# EasyEDA Pro project ProProject_KVM-Card-Mini-HV2.6_2023-09-18.epro, schematic schematic1

## Sheets
1 VIDEO: Create Date: 2023-07-25; Page Name: VIDEO; Project Name: KVM-Card-Mini-private; Schematic Name: schematic1; Update Date: 2023-08-08; Company: 嘉立创EDA; Page Size: A3; Version: V1.0
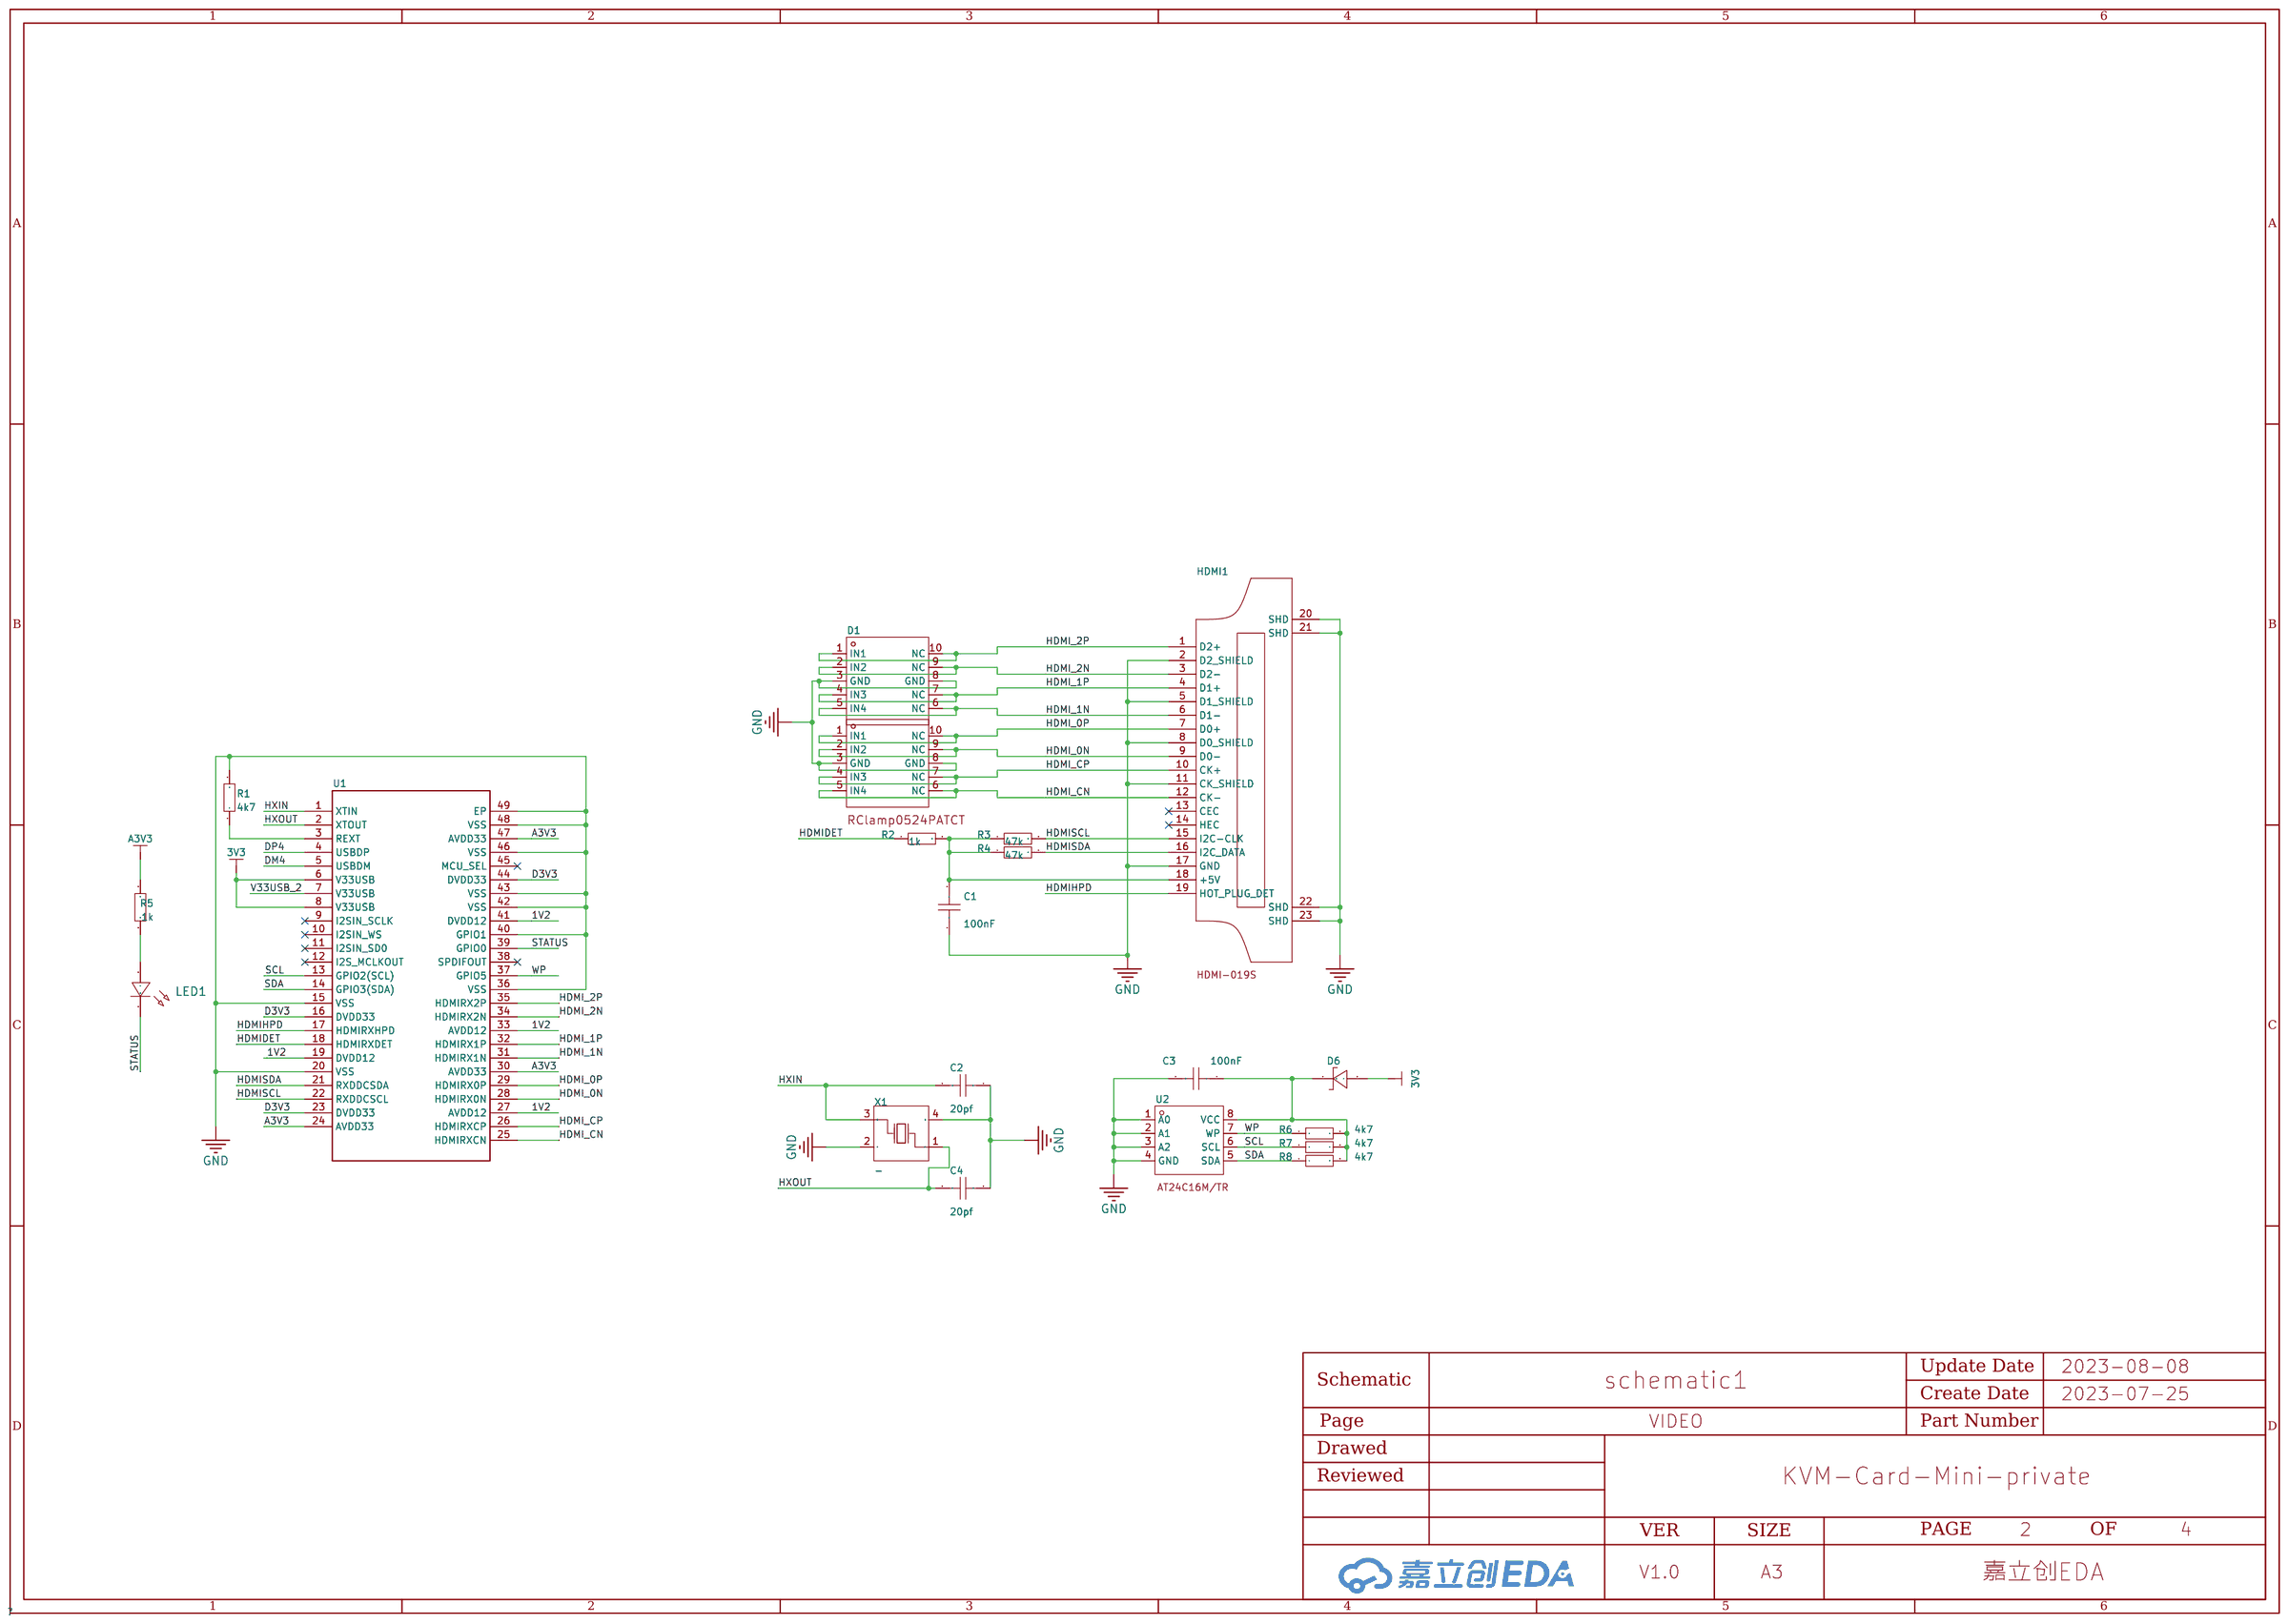
[diagram p0: VIDEO]
2 USB: Create Date: 2023-08-23; Page Name: USB; Project Name: KVM-Card-Mini-plus; Update Date: 2023-08-23
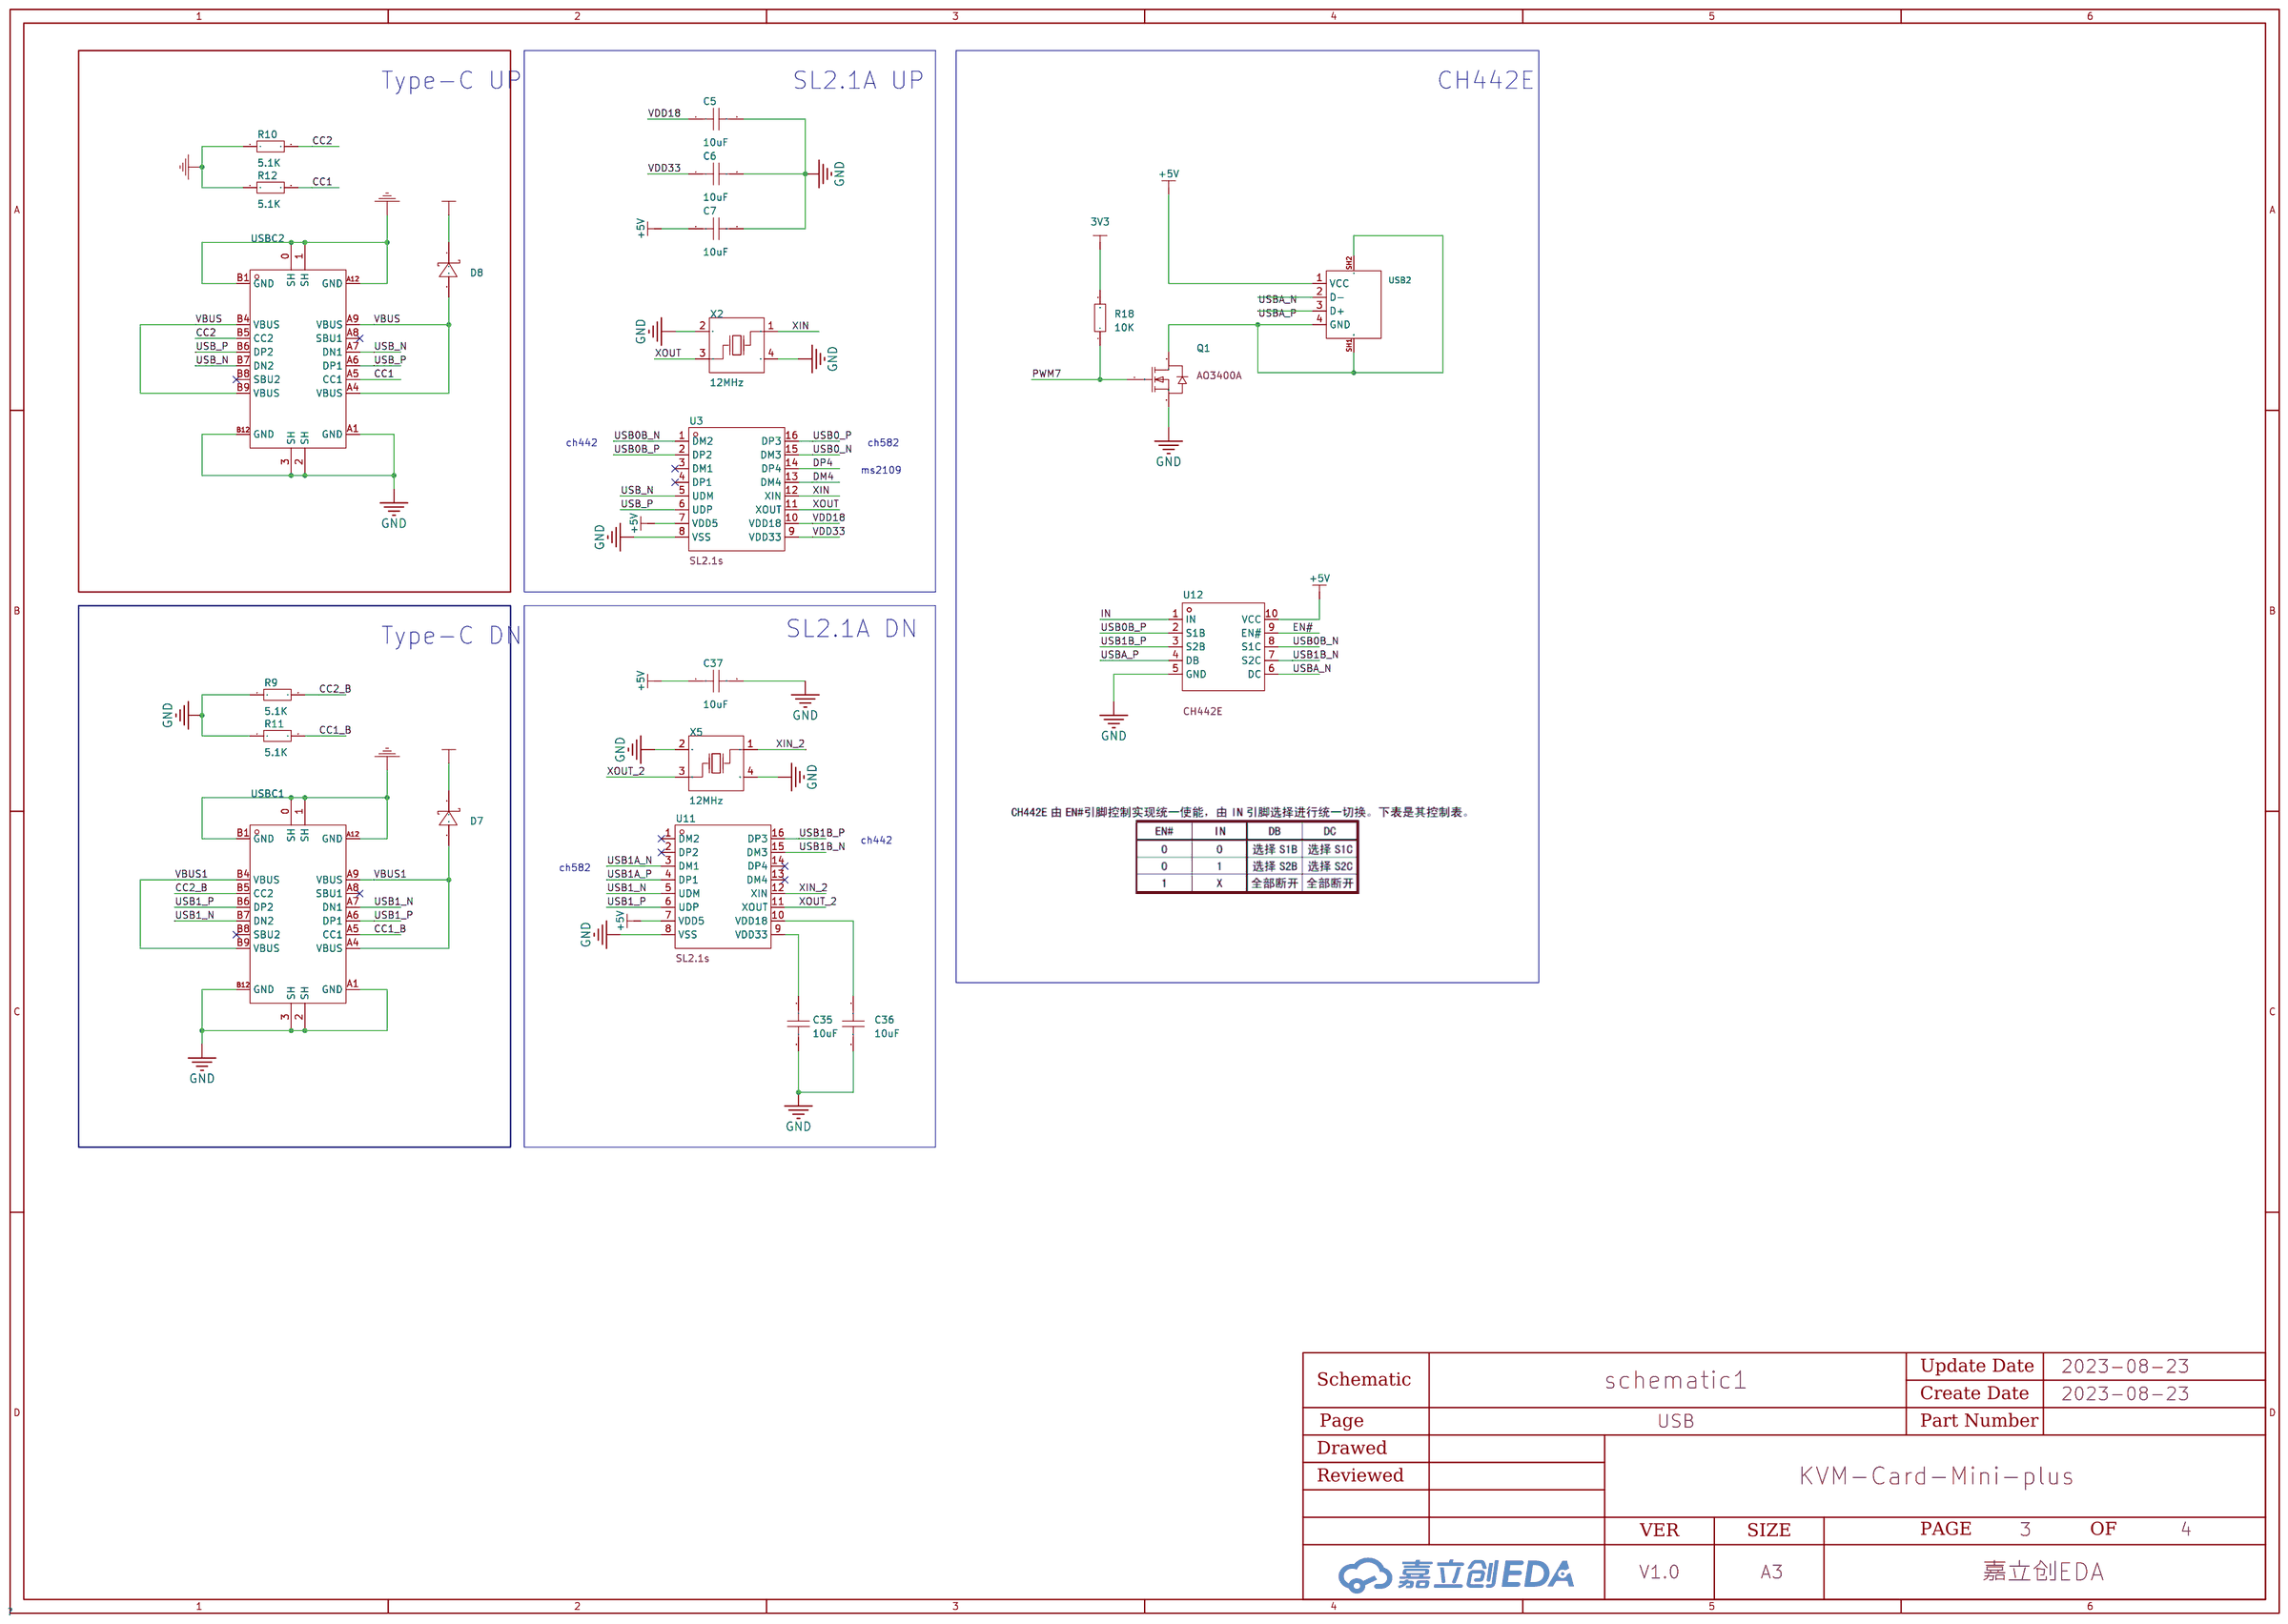
[diagram p1: USB]
3 MCU: Create Date: 2023-08-23; Page Name: MCU; Project Name: KVM-Card-Mini-plus; Update Date: 2023-08-23
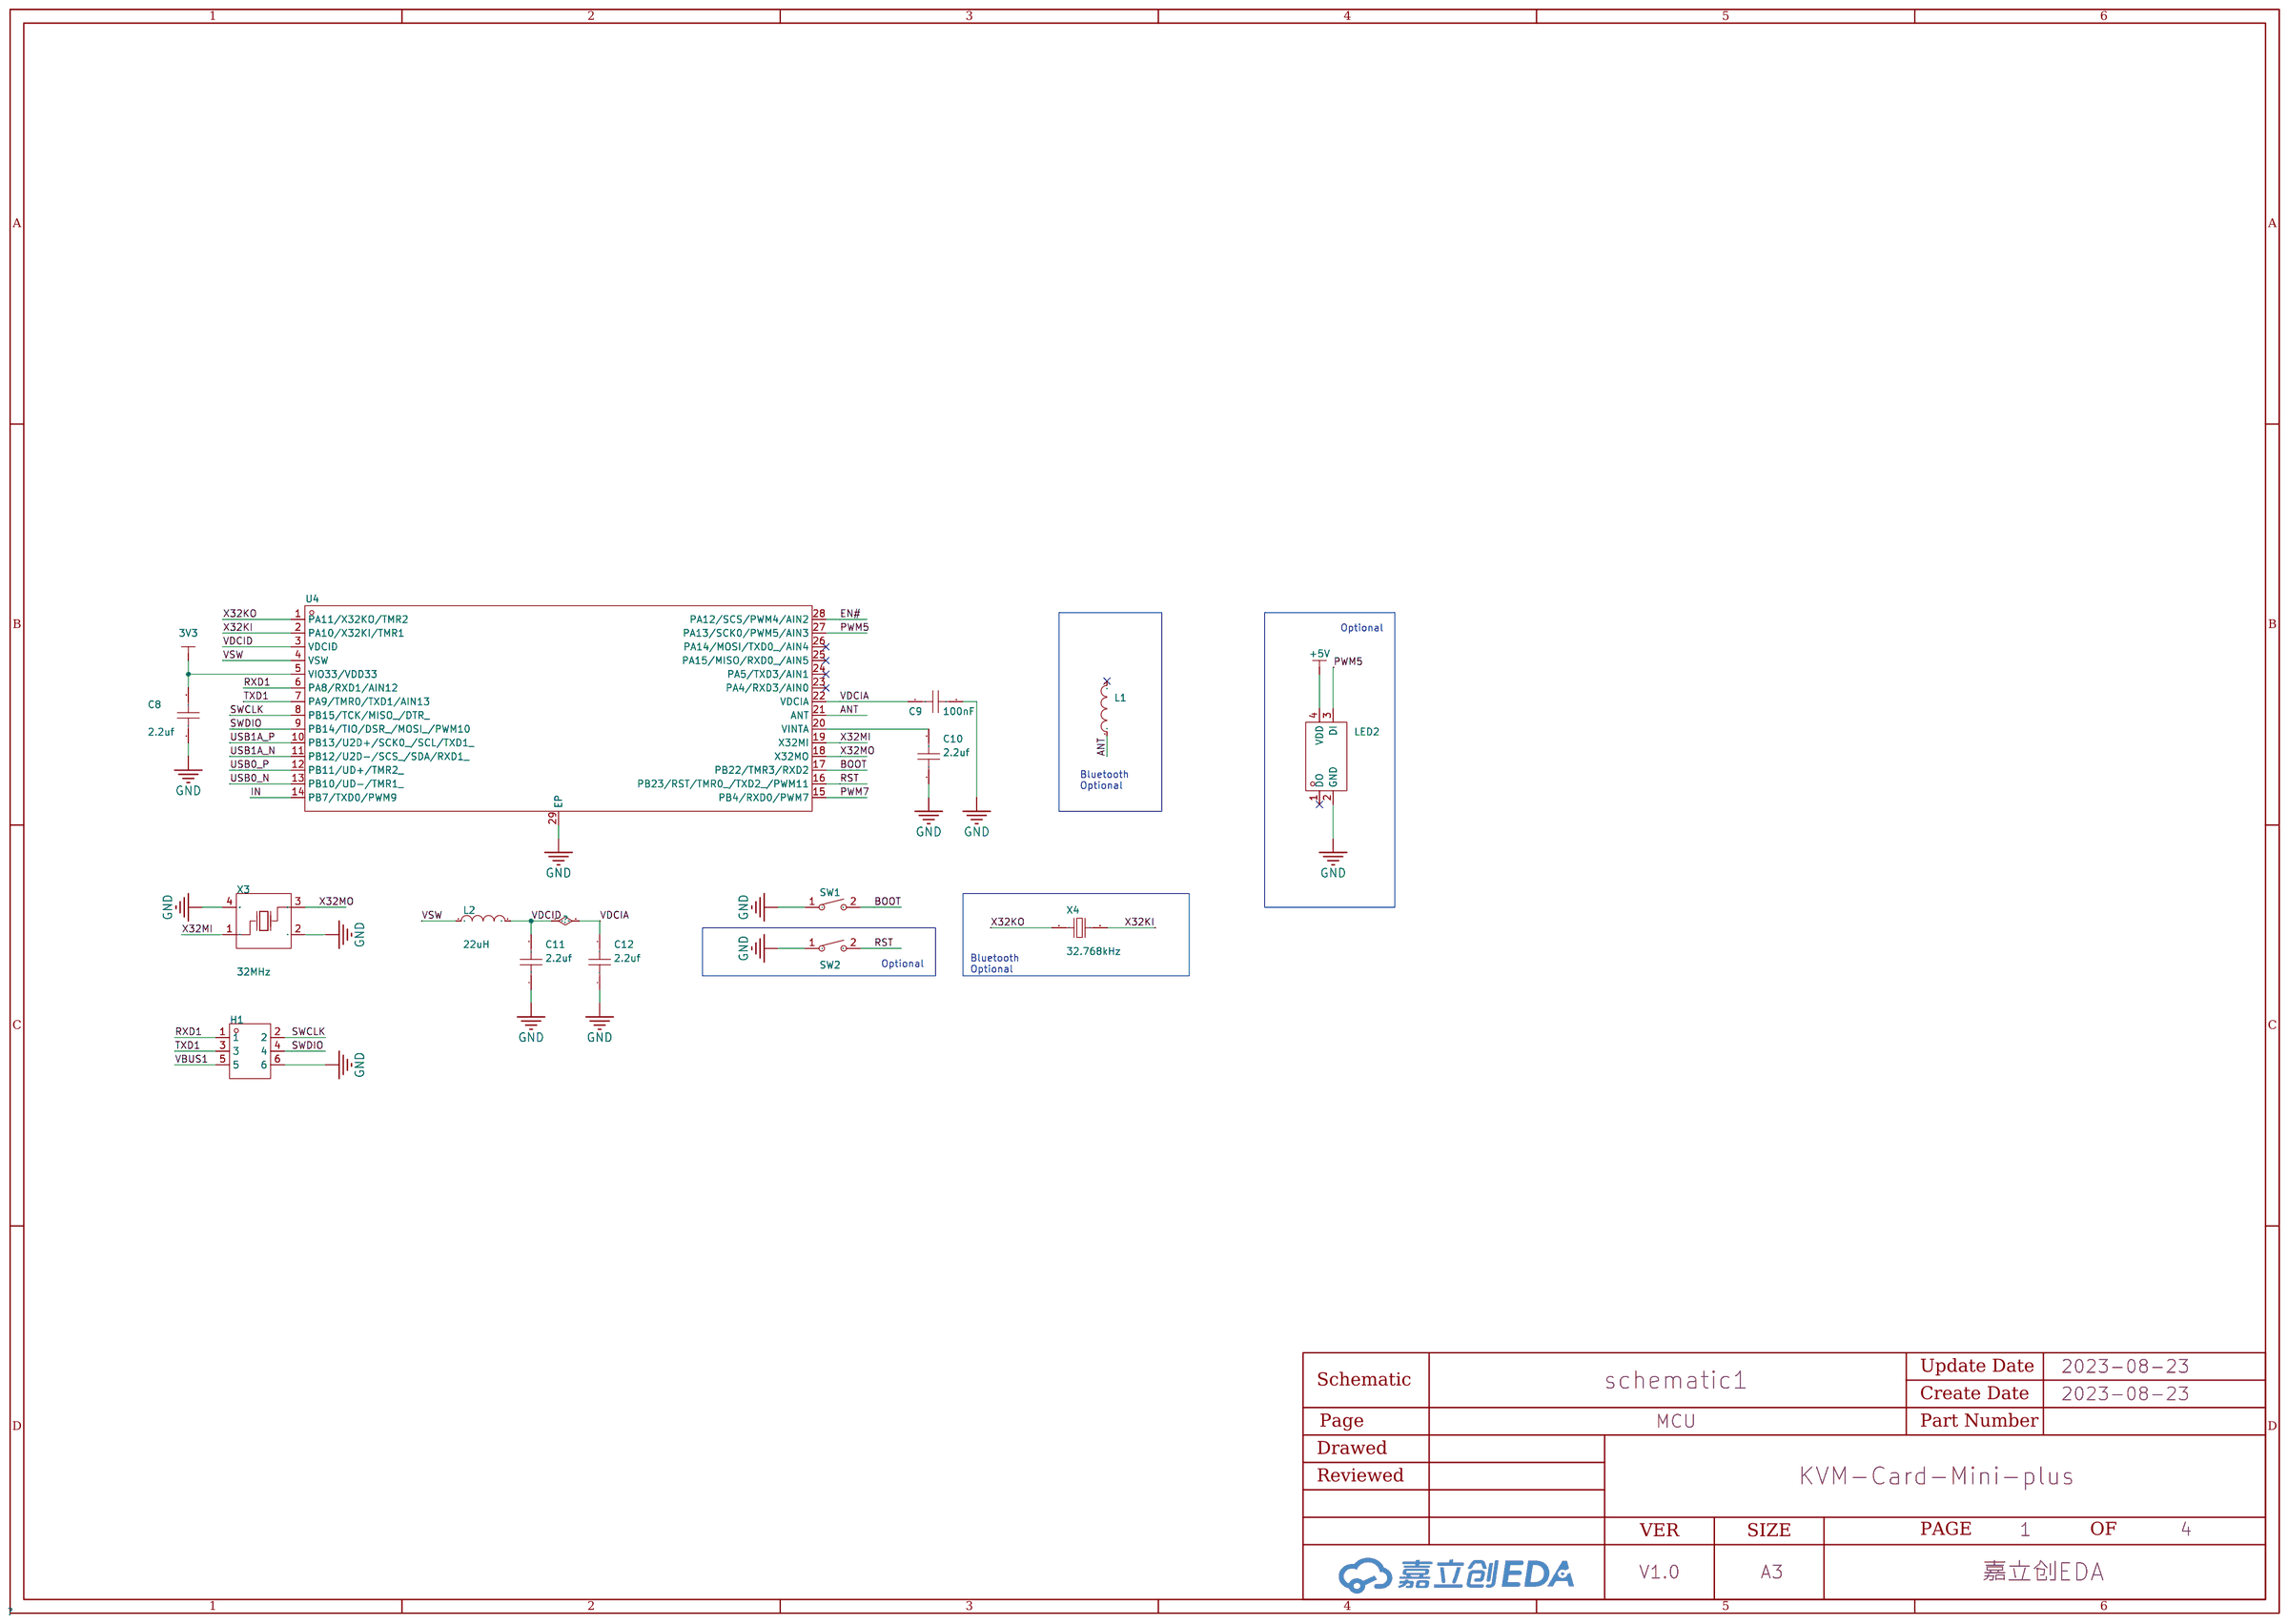
[diagram p2: MCU]
4 POWER: Page Name: POWER; Update Date: 2023-07-25
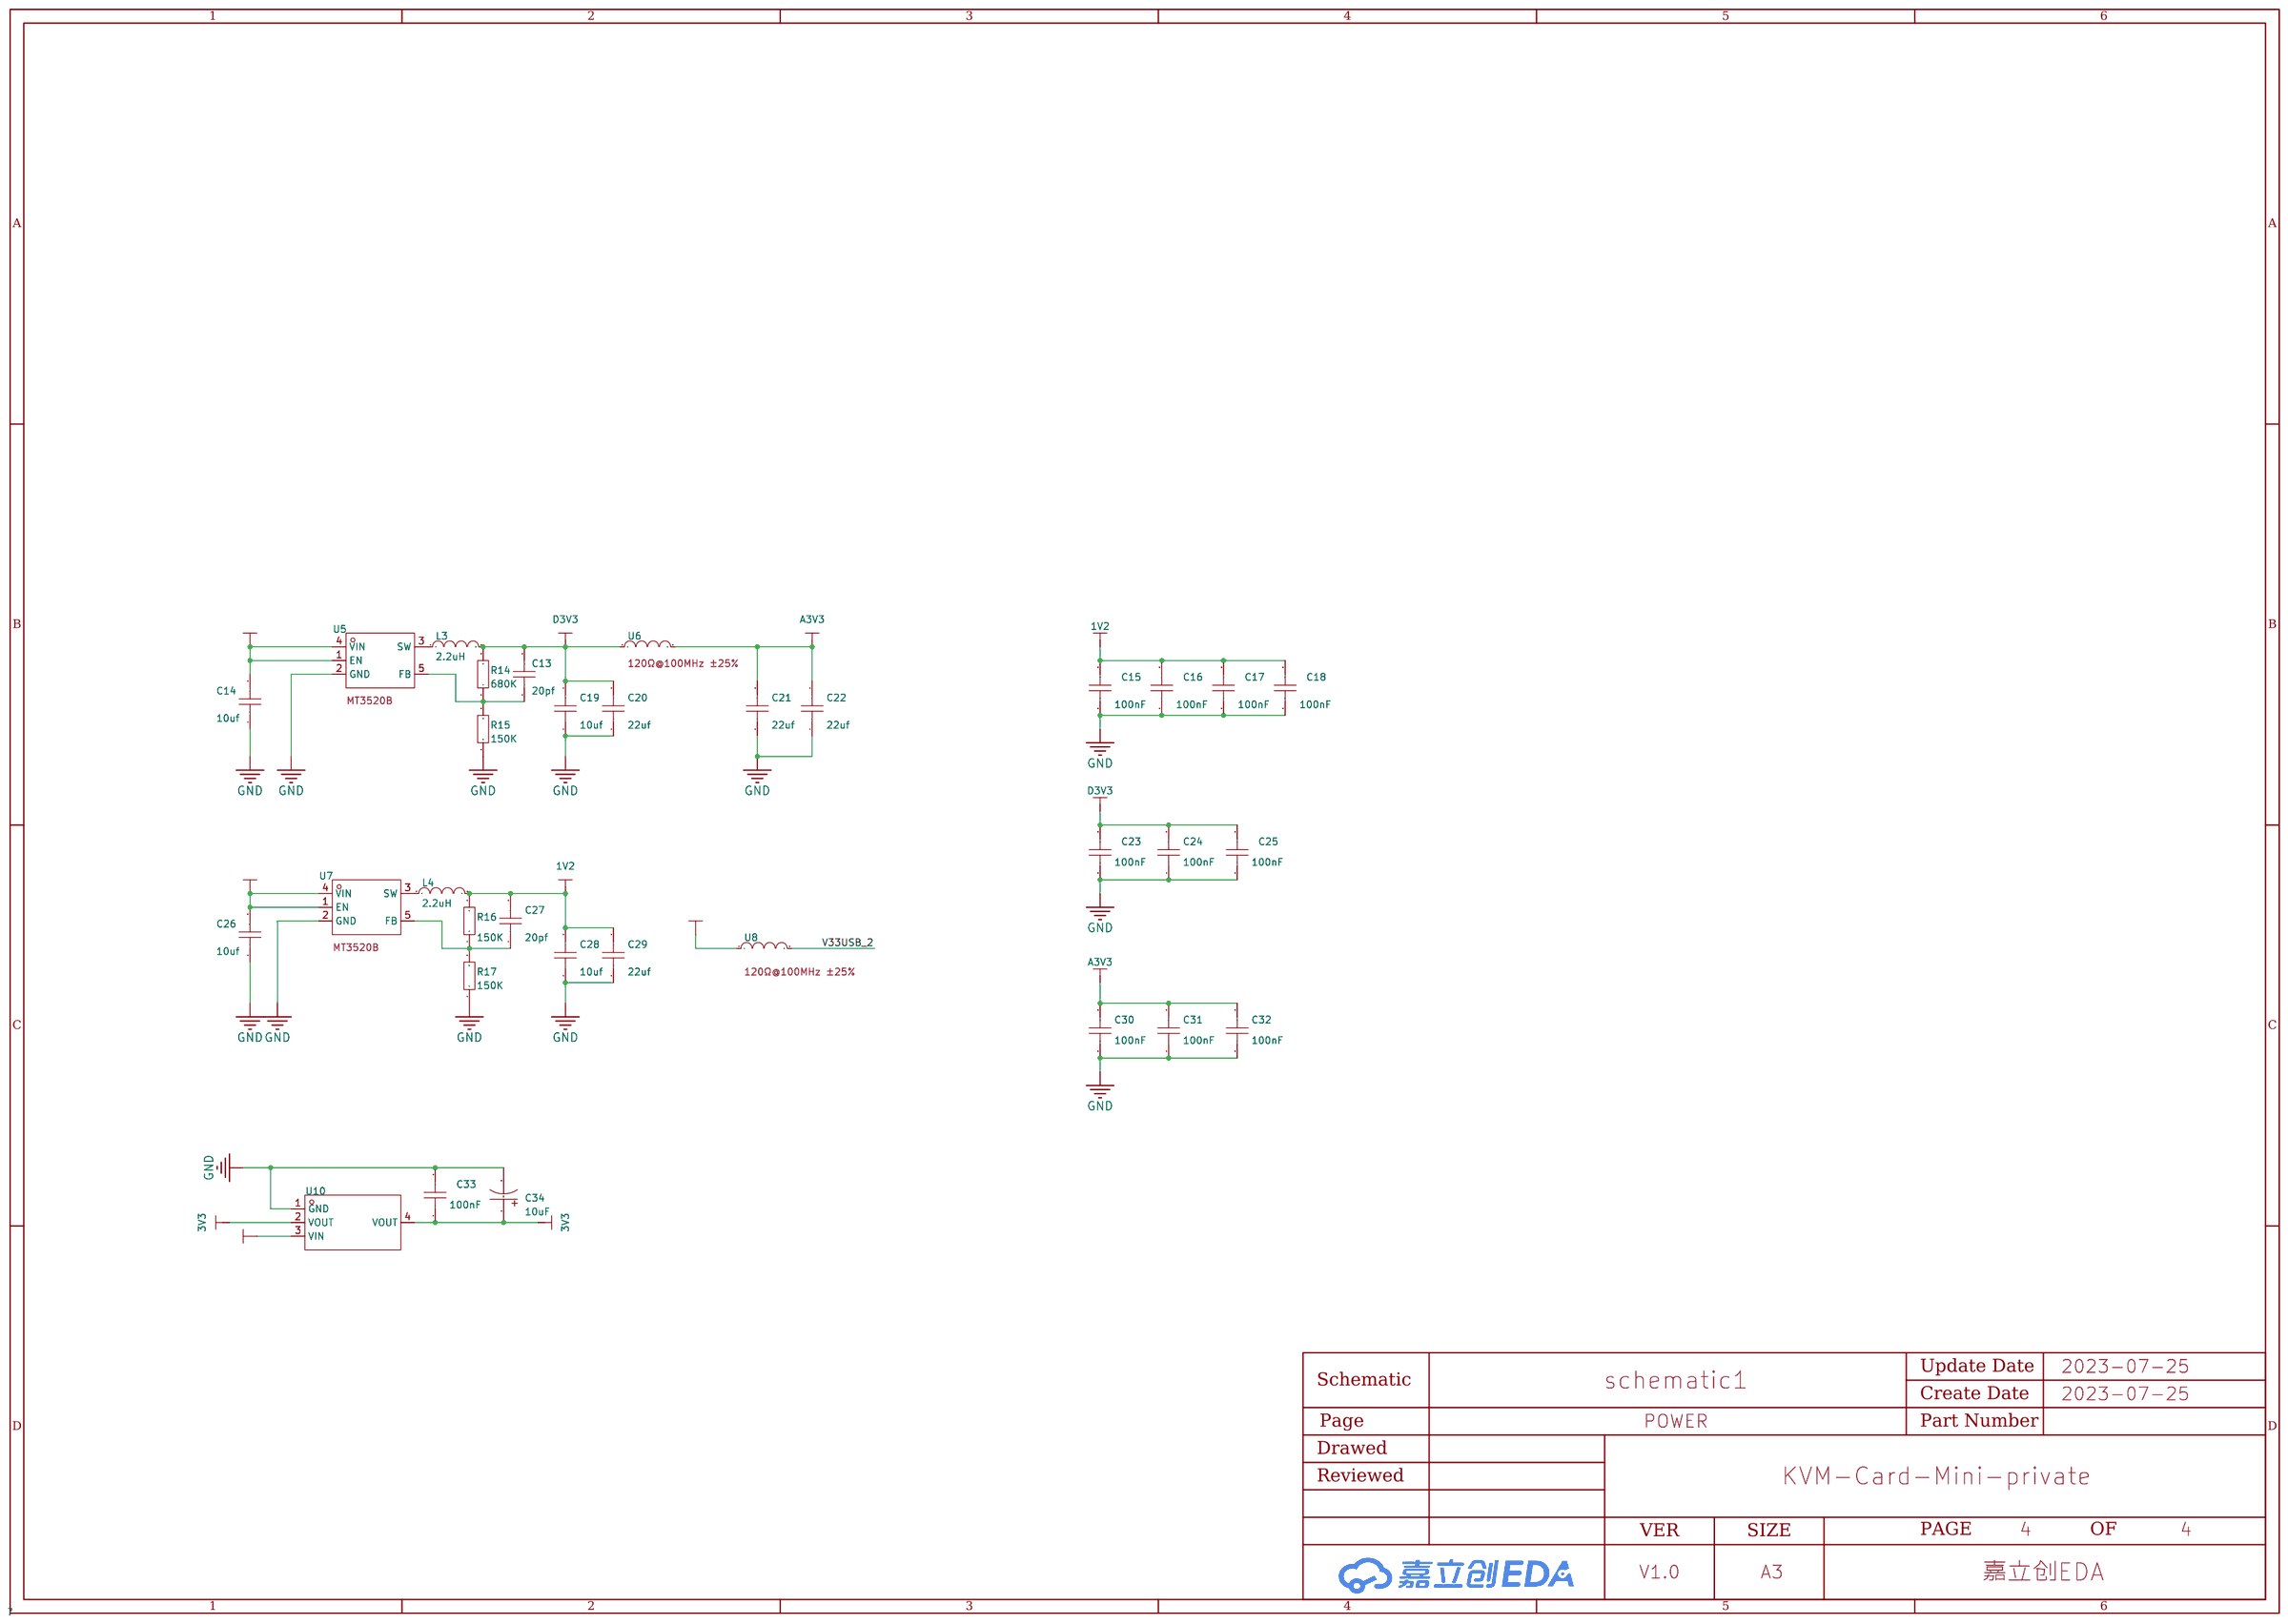
[diagram p3: POWER]

## Parts
sheet MCU
C8  2.2uf  [C0603]
C9  100nF  [C0603]
C10  2.2uf  [C0603]
C11  2.2uf  [C0603]
C12  2.2uf  [C0603]
H1  210-72-03GB01  [HDR-TH_6P-P2.54-V-R2-C3-S2.54_A2541WV-2X3P]
L1  RFECA3216060A1T  [ANT-SMD_L3.1-W1.6]
L2  22uH  [IND-SMD_L2.0-W1.6_NR201610]
LED2  WS2812B-2020  [LED-SMD_4P-L2.0-W2.0-TL_WS2812B-2020]
SW1  BOOT  [SW-SMD_L4.0-W2.9-LS5.0]
SW2  RST  [SW-SMD_L4.0-W2.9-LS5.0]
U4  CH582F  [QFN-28_L4.0-W4.0-P0.40-BL-EP2.8]
X3  32MHz  [CRYSTAL-SMD_4P-L2.0-W1.6-BL-2]
X4  32.768kHz  [FC-135R_L3.2-W1.5]
sheet POWER
C13  20pf  [C0603]
C14  10uf  [C0603]
C15  100nF  [C0603]
C16  100nF  [C0603]
C17  100nF  [C0603]
C18  100nF  [C0603]
C19  10uf  [C0603]
C20  22uf  [C0603]
C21  22uf  [C0603]
C22  22uf  [C0603]
C23  100nF  [C0603]
C24  100nF  [C0603]
C25  100nF  [C0603]
C26  10uf  [C0603]
C27  20pf  [C0603]
C28  10uf  [C0603]
C29  22uf  [C0603]
C30  100nF  [C0603]
C31  100nF  [C0603]
C32  100nF  [C0603]
C33  100nF  [C0603]
C34  10uF  [CASE-A_3216]
L3  2.2uH  [IND-SMD_L2.0-W1.6]
L4  2.2uH  [IND-SMD_L2.0-W1.6]
R14  680K  [R0603]
R15  150K  [R0603]
R16  150K  [R0603]
R17  150K  [R0603]
U5  -  [SOT-23-5_L3.0-W1.7-P0.95-LS2.8-BR]
U6  BLM18PG121SN1D  [L0603]
U7  -  [SOT-23-5_L3.0-W1.7-P0.95-LS2.8-BR]
U8  BLM18PG121SN1D  [L0603]
U10  AMS1117-3.3  [SOT-223-3_L6.5-W3.4-P2.30-LS7.0-BR]
sheet USB
C5  10uF  [C0603]
C6  10uF  [C0603]
C7  10uF  [C0603]
C35  10uF  [C0603]
C36  10uF  [C0603]
C37  10uF  [C0603]
D7  SS34  [SMA_L4.3-W2.6-LS5.2-RD]
D8  SS34  [SMA_L4.3-W2.6-LS5.2-RD]
Q1  AO3400A  [SOT-23-3_L2.9-W1.6-P1.90-LS2.8-BR]
R9  5.1K  [R0603]
R10  5.1K  [R0603]
R11  5.1K  [R0603]
R12  5.1K  [R0603]
R18  10K  [R0603]
U3  SL2.1s  [SSOP-16_L4.6-W2.6-P0.53-LS4.0-BL]
U11  SL2.1s  [SSOP-16_L4.6-W2.6-P0.53-LS4.0-BL]
U12  CH442E  [MSOP-10_L3.0-W3.0-P0.50-LS5.0-BL]
USB2  902-131A1011D10100  [USB-A-TH__USB-AF-90]
USBC1  TYPE-C-31-M-12  [USB-C_SMD-TYPE-C-31-M-12]
USBC2  TYPE-C-31-M-12  [USB-C_SMD-TYPE-C-31-M-12]
X2  12MHz  [CRYSTAL-SMD_4P-L3.2-W2.5-BL]
X5  12MHz  [CRYSTAL-SMD_4P-L3.2-W2.5-BL]
sheet VIDEO
C1  100nF  [C0603]
C2  20pf  [C0603]
C3  100nF  [C0603]
C4  20pf  [C0603]
D1  -  [SLP2510P8_L2.5-W1.0-P0.50-BL]
D2  -  [SLP2510P8_L2.5-W1.0-P0.50-BL]
D6  1N5819WS  [SOD-323_L1.8-W1.3-LS2.5-RD]
HDMI1  -  [HDMI-SMD_HDMI-019S]
LED1  -  [LED_0603]
R1  4k7  [R0603]
R2  1k  [R0603]
R3  47k  [R0603]
R4  47k  [R0603]
R5  1k  [R0603]
R6  4k7  [R0603]
R7  4k7  [R0603]
R8  4k7  [R0603]
U1  MS2109  [QFN-48_L7.0-W7.0-P0.50-TL-EP4.1]
U2  -  [SOP-8_L4.9-W3.9-P1.27-LS6.0-BL]
X1  -  [OSC-SMD_4P-L3.2-W2.5-BL]

## Library data of the parts
C1-C4 C8-C33 = CAP_0603: 容值:100nF;精度:±10%;额定电压:50V;温度系数:X7R;; Supplier Footprint: 0603
H1 = 210-72-03GB01: 排数:双排;总PIN位数:6;间距:2.54mm;插针结构:2x3P;行距:2.54mm;安装类型:直插;圆针/方针:方针;额定电流:-;额定电压:-;配合针长度:6.1mm;塑高:2.5mm;端接针长度:3mm;触头材质:黄铜;触头镀层:-;工作温度范围:-40℃~+105℃;颜色:黑色;; LCSC Part Name: 2.54mm 2x3P 直插 方针; Supplier Part: C402781; Manufacturer: PINREX(频锐科技); Supplier Footprint: 直插,P=2.54mm; JLCPCB Part Class: 扩展库; Datasheet: https://atta.szlcsc.com/upload/public/pdf/source/20190710/C402781_43A1999CD2F74066250BE88CD0917A4C.pdf; Supplier: LCSC; Number of Rows: 双排; Number of Pins: 6; Pitch: 2.54mm; Pin Structure: 2x3P; Row Spacing: 2.54mm; Mounting Type: 直插; Circluar Pins/Square Pins: 方针; Length of Mating Pin: 6.1mm; Insulation Height: 2.5mm; Length of End Connection Pin: 3mm; Contact Material: 黄铜; Operating Temperature Range: -40℃~+105℃; Color: 黑色
L1 = RFECA3216060A1T: 2.4 GHz 陶瓷天线; Supplier Part: C127620; Manufacturer: Walsin(华新科); Supplier Footprint: 贴片; JLCPCB Part Class: 扩展库; Datasheet: https://atta.szlcsc.com/upload/public/pdf/source/20180326/C127620_3C564CCA307EE04222EAFCE04B7FD99A.pdf; Supplier: LCSC
L2 = YNR2016-220M: 电感值:22uH;精度:±20%;额定电流:300mA;饱和电流(Isat):300mA;; LCSC Part Name: 22uH ±20% 300mA 1.7Ω; Supplier Part: C2858408; Manufacturer: YJYCOIN(益嘉源); Supplier Footprint: SMD,2x1.6x1.05mm; JLCPCB Part Class: 扩展库; Datasheet: https://atta.szlcsc.com/upload/public/pdf/source/20220803/D55B945E8F3B883D081ACE749E0E15DB.pdf; Supplier: LCSC; Tolerance: ±20%; Rated Current: 300mA; Saturation Current (Isat): 300mA; DC Resistance (DCR): 1.7Ω
LED2 = WS2812B-2020: 发光颜色:RGB三色;二极管配置:-;透镜颜色:-;主波长:470.4nm；622.5nm；515.6nm;峰值波长:-;色温:-;测试电流:12mA;功率:-;发光角度:-;安装方式:-;工作温度:-;; LCSC Part Name: RGB三色 470.4nm 515.6nm 622.5nm （注意防潮，请查阅规格书中对应具体内容）; Supplier Part: C965555; Manufacturer: worldsemi; Supplier Footprint: SMD,2x2mm; JLCPCB Part Class: 扩展库; Datasheet: https://atta.szlcsc.com/upload/public/pdf/source/20201203/C965555_5C919C4B6231E6ADE06011FB0D94282B.pdf; Supplier: LCSC; Emitted Color: RGB三色; Dominant Wavelength: 470.4nm；622.5nm；515.6nm; Forward Current: 12mA
SW1 SW2 = TS342A2P-WZ: 触点电流:50mA;额定电压(DC):12V;绝缘电阻:100MΩ;电路结构:单刀单掷;安装方式:立贴;按钮形状:圆形按钮;按钮/盖帽颜色:黑色;机械寿命:30000;工作温度:-25℃~+70℃;引脚样式:SMD接片;开关长度:3.95mm;开关宽度:2.9mm;开关高度:2mm;带支架:否;; LCSC Part Name: 轻触开关 3*4*2 两脚小龟不带柱 250gf 黑色塑胶按钮; Supplier Part: C557591; Manufacturer: SHOU HAN(首韩); Supplier Footprint: SMD; JLCPCB Part Class: 扩展库; Datasheet: https://atta.szlcsc.com/upload/public/pdf/source/20200519/C557591_B3A5A21584733303F06306F18577DA8B.pdf; Supplier: LCSC; Contact Current: 50mA; Voltage Rating (DC): 12V; Insulation Resistance: 100MΩ; Circuit: 单刀单掷; Mounting Style: 立贴; Actuator Style: 圆形按钮; Actuator/Cap Color: 黑色; Mechanical Life: 30000; Operating Temperature: -25℃~+70℃; Pin Style: SMD接片; Switch Length: 3.95mm; Switch Width: 2.9mm; Switch Height: 2mm; Strike Gundam: 否
U4 = CH582F: Supplier Part: C3001175; Manufacturer: WCH(南京沁恒); Supplier Footprint: QFN28; JLCPCB Part Class: 扩展库; Datasheet: https://atta.szlcsc.com/upload/public/pdf/source/20220425/D81D4537E275CD6C7C3E77BC95B144F3.pdf; Supplier: LCSC
X3 = XL7EL89COI-111YLC-32M: 频率:32MHz;频率公差:±10ppm;负载电容:12pF;; LCSC Part Name: 32MHz ±10ppm 12pF YSX211SL; Supplier Part: C2965584; Manufacturer: YXC(扬兴晶振); Supplier Footprint: SMD2016-4P; Datasheet: https://atta.szlcsc.com/upload/public/pdf/source/20220121/6B4B3E7EF7974858943D806BF8CACEA3.pdf; Supplier: LCSC; Crystal Type: 贴片无源晶振; Frequency Tolerance: ±10ppm; Frequency Stability: ±20ppm; Load Capacitance: 12pF; Operating Temperature: -40℃~+85℃
X4 = Q13FC1350000400: 晶振类型:贴片无源晶振;频率:32.768kHz;频率公差:±20ppm;负载电容:12.5pF;等效串联电阻(ESR):70kΩ;工作温度:-40℃~+85℃;; LCSC Part Name: 32.768kHz ±20ppm 12.5pF; Supplier Part: C32346; Manufacturer: EPSON(爱普生); Supplier Footprint: SMD3215-2P; JLCPCB Part Class: 基础库; Datasheet: https://atta.szlcsc.com/upload/public/pdf/source/20190108/C32346_746D6B07EAF90824457A96480007685F.pdf; Supplier: LCSC; Crystal Type: 贴片无源晶振; Frequency Tolerance: ±20ppm; Load Capacitance: 12.5pF; Equivalent Series Resistance (ESR): 70kΩ; Operating Temperature: -40℃~+85℃
C34 = CA45-A-6.3V-10uF-K: 容值:10uF;精度:±10%;额定电压:6.3V;等效串联电阻:8Ω@100kHz;; LCSC Part Name: 10uF ±10% 6.3V; Supplier Part: C128255; Manufacturer: CEC(振华新云); Supplier Footprint: CASE-A-3216; JLCPCB Part Class: 扩展库; Datasheet: https://atta.szlcsc.com/upload/public/pdf/source/20180125/C128255_15168614678451301481.pdf; Supplier: LCSC; Tolerance: ±10%; Rated Voltage: 6.3V; Equivalent Series Resistance(ESR): 8Ω@100kHz; Operating Temperature: -55℃~+125℃
L3 L4 = CKCS201610-2.2uH/M: 电感值:2.2uH;精度:±20%;额定电流:1.1A;; LCSC Part Name: 2.2uH ±20% 1.1A 264mΩ; Supplier Part: C354533; Manufacturer: CENKER(岑科); Supplier Footprint: SMD; JLCPCB Part Class: 扩展库; Datasheet: https://atta.szlcsc.com/upload/public/pdf/source/20190315/C354533_59121B22FE01331804674A67C9C7C2C4.pdf; Supplier: LCSC; Tolerance: ±20%; Rated Current: 1.1A; DC Resistance (DCR): 264mΩ
R1-R12 R14-R18 = Res_0603: Supplier Footprint: 0603
U5 U7 = MT3520B_2: Pin Type: IN; Supplier: LCSC; Supplier Part: C2684933; Manufacturer: 西安航天民芯; Manufacturer Part: MT3520B; JLCPCB Part Class: Extended Part
U6 U8 = BLM18PG121SN1D: 标称阻抗@测试频率:120Ω@100MHz;误差:±25%;直流电阻(RDC):50mΩ;额定电流:2A;电路数:1;; LCSC Part Name: 120Ω@100MHz ±25%; Supplier Part: C14709; Manufacturer: muRata(村田); Supplier Footprint: SMD; JLCPCB Part Class: 扩展库; Datasheet: https://atta.szlcsc.com/upload/public/pdf/source/20130704/1457706621134.pdf; Supplier: LCSC; Impedance @ Frequency: 120Ω@100MHz; Tolerance: ±25%; DC Resistance: 50mΩ; Current Rating: 2A; Circuits: 1
U10 = AMS1117-3.3_C6186: 输出类型:固定;输出极性:正;最大输入电压:-;输出电压:3.3V;输出电流:1A;电源纹波抑制比(PSRR):72dB@(120Hz);; LCSC Part Name: 输出3.3V 1A; Supplier Part: C6186; Manufacturer: AMS; Supplier Footprint: SOT-223; JLCPCB Part Class: 基础库; Datasheet: https://atta.szlcsc.com/upload/public/pdf/source/20180727/C6186_7A095716F0823C02F1997A905E26C086.pdf; Supplier: LCSC; Output Type: 固定; Output Polarity: 正; Number of Outputs: 1; Output Voltage: 3.3V; Dropout Voltage: 1.3V@(800mA); Output Current: 1A; Power Supply Rejection Ratio (PSRR): 72dB@(120Hz)
C5-C7 C35-C37 = CL10A106MA8NRNC: 容值:10uF;精度:±20%;额定电压:25V;温度系数:X5R;; LCSC Part Name: 10uF ±20% 25V; Supplier Part: C96446; Manufacturer: SAMSUNG(三星); Supplier Footprint: 0603; JLCPCB Part Class: Basic Part; Datasheet: https://atta.szlcsc.com/upload/public/pdf/source/20170325/1490427913016.pdf; Supplier: LCSC; Tolerance: ±20%; Voltage Rated: 25V; Temperature Coefficient: X5R
D7 D8 = SS34_C8678: 二极管配置:独立式;直流反向耐压(Vr):40V;平均整流电流(Io):3A;正向压降(Vf):550mV@3A;; LCSC Part Name: 40V 3A 550mV@3A; Supplier Part: C8678; Manufacturer: MDD; Supplier Footprint: SMA(DO-214AC); JLCPCB Part Class: 基础库; Datasheet: https://atta.szlcsc.com/upload/public/pdf/source/20230314/A80AE34493C69B89E2F4B1712F433538.pdf; Supplier: LCSC; Diode Configuration: 独立式; Reverse Voltage (Vr): 40V; Average Rectified Current (Io): 3A; Forward Voltage (Vf@If): 550mV@3A; Reverse Leakage Current (Ir): 500uA@40V
Q1 = AO3400A_C20917: 类型:N沟道;漏源电压(Vdss):30V;连续漏极电流(Id):5.7A;功率(Pd):1.4W;导通电阻(RDS(on)@Vgs,Id):26.5mΩ@10V,5.7A;; LCSC Part Name: N沟道 30V 5.7A; Supplier Part: C20917; Manufacturer: AOS; Supplier Footprint: SOT-23-3L; JLCPCB Part Class: 基础库; Datasheet: https://atta.szlcsc.com/upload/public/pdf/source/20140107/1457706668533.pdf; Supplier: LCSC; Type: N沟道; Drain Source Voltage (Vdss): 30V; Continuous Drain Current (Id): 5.7A; Power Dissipation (Pd): 1.4W; Drain Source On Resistance (RDS(on)@Vgs,Id): 26.5mΩ@10V,5.7A; Gate Threshold Voltage (Vgs(th)@Id): 1.5V@250uA
U3 U11 = SL2.1s: 类型:-;协议类别:-;驱动器/接收器数:-;数据速率:-;; Supplier Part: C2684433; Manufacturer: CoreChips(和芯润德); JLCPCB Part Class: 扩展库; Datasheet: https://atta.szlcsc.com/upload/public/pdf/source/20210326/C2684433_0308B0C984AD3FC6CBDA43F1CDB06B3F.pdf; Supplier: LCSC
U12 = CH442E: 开关电路:-;; Supplier Part: C150097; Manufacturer: WCH(南京沁恒); Supplier Footprint: MSOP-10; JLCPCB Part Class: 扩展库; Datasheet: https://atta.szlcsc.com/upload/public/pdf/source/20200819/C150097_5F119D8C6C985BEC7C640F1A1265D167.pdf; Supplier: LCSC
USB2 = 902-131A1011D10100: 连接器类型:Type-A;标准:USB 2.0;公母:母座;触点数量:4;端口数量:1;; LCSC Part Name: Type-A 母座; Supplier Part: C2345; Manufacturer: 精拓金; Supplier Footprint: 插件; Supplier: LCSC; Connector Type: Type-A; Standard: USB 2.0; Gender: 母座; Number of Contacts: 4; Number of Ports: 1
USBC1 USBC2 = TYPE-C-31-M-12: 连接器类型:Type-C;标准:-;公母:母座;触点数量:16;端口数量:1;安装方式:-;额定电流 - 电源:5A;触头材质:-;触头镀层:-;工作温度范围:-;焊接温度(最大值):-;; LCSC Part Name: Type-C 母座; Supplier Part: C165948; Manufacturer: 韩国韩荣; Supplier Footprint: SMD; JLCPCB Part Class: 扩展库; Datasheet: https://atta.szlcsc.com/upload/public/pdf/source/20220525/466408E853115E789EDB0DDC29077C05.pdf; Supplier: LCSC; Connector Type: Type-C; Gender: 母座; Number of Contacts: 16; Number of Ports: 1; Current Rating - Power (Max): 5A
X2 X5 = Q22FA23V0041800: 晶振类型:贴片无源晶振;频率:12MHz;频率公差:±20ppm;频率稳定度:-;负载电容:18pF;等效串联电阻(ESR):100Ω;工作温度:-40~+85;; LCSC Part Name: 12MHz ±20ppm 18pF; Supplier Part: C91749; Manufacturer: EPSON(爱普生); Supplier Footprint: SMD3225-4P; JLCPCB Part Class: Extended Part; Datasheet: https://atta.szlcsc.com/upload/public/pdf/source/20180607/C91749_498DD7D6A132F22CC899BC8E162EB8BB.pdf; Supplier: LCSC; Crystal Type: 贴片无源晶振; Frequency Tolerance: ±20ppm; Load Capacitance: 18pF; Equivalent Series Resistance (ESR): 100Ω; Operating Temperature: -40~+85
D1 D2 = RClamp0524PATCT: VBR=6V， Vc=15V ，Ipp=5A; Supplier Part: C40960; Manufacturer: SEMTECH; Supplier Footprint: SLP2510P8; JLCPCB Part Class: Extended Part; Datasheet: https://atta.szlcsc.com/upload/public/pdf/source/20150124/1457707260739.pdf; Supplier: LCSC
D6 = 1N5819WS_C191023: 直流反向耐压(Vr):40V;平均整流电流(Io):1A;正向压降(Vf):600mV@1A;; LCSC Part Name: 40V 1A 600mV@1A; Supplier Part: C191023; Manufacturer: Hottech(合科泰); Supplier Footprint: SOD-323; Datasheet: https://atta.szlcsc.com/upload/public/pdf/source/20220428/3CB86FD8D28D653594B4E35F9D5AEFD9.pdf; Supplier: LCSC; Reverse Voltage (Vr): 40V; Average Rectified Current (Io): 1A; Forward Voltage (Vf@If): 600mV@1A
HDMI1 = HDMI-019S: 连接器类型:HDMI;公母:母;总PIN位数:19;排数:-;安装方式:卧贴;额定电流:500mA;工作温度范围:-25~+75;; LCSC Part Name: HDMI 母 P数:19; Supplier Part: C111617; Manufacturer: SOFNG(硕方); Supplier Footprint: SMD; JLCPCB Part Class: Extended Part; Datasheet: https://atta.szlcsc.com/upload/public/pdf/source/20200911/C111617_84DD1BD35B9EB8A28224A63520745D0A.pdf; Supplier: LCSC; Connector Type: HDMI; Gender: 母; Number of Pins: 19; Mounting Style: 卧贴; Current Rating (Max): 500mA; Operating Temperature Range: -25~+75
LED1 = LED_0603-R: Supplier Footprint: 0603
U1 = MS2109: Datasheet: 无
U2 = AT24C16M/TR: Supplier Part: C356701; Manufacturer: HGSEMI(华冠); Supplier Footprint: SOP-8; JLCPCB Part Class: Extended Part; Datasheet: https://atta.szlcsc.com/upload/public/pdf/source/20220714/5A9938374CA1B0C07A427C61968786F5.pdf; Supplier: LCSC
X1 = SX32Y024000BC1T: 频率:-;负载电容:-;; LCSC Part Name: 3225 24M 12PF  10ppm  -20 -75℃; Supplier Part: C271629; Manufacturer: TKD(泰晶); Supplier Footprint: SMD3225-4P; JLCPCB Part Class: 扩展库; Datasheet: https://atta.szlcsc.com/upload/public/pdf/source/20180829/C271629_CA81D930E8823EB83EE4F79A596DDEFE.pdf; Supplier: LCSC

## Nets
1V2: C15.2 C16.2 C17.2 C18.2 C27.2 C28.2 C29.2 L4.2 R16.2 U1.19(DVDD12) U1.27(AVDD12) U1.33(AVDD12) U1.41(DVDD12)
3V3: C8.2 C33.1 C34.1 D6.2(A) R18.2 U1.6(V33USB) U1.8(V33USB) U4.5(VIO33/VDD33) U10.2(VOUT) U10.4(VOUT)
+5V: C7.1 C14.2 C26.2 C37.1 D7.1(K) D8.1(K) LED2.4(VDD) U3.7(VDD5) U5.1(EN) U5.4(VIN) U7.1(EN) U7.4(VIN) U8.1 U10.3(VIN) U11.7(VDD5) U12.10(VCC) USB2.1(VCC)
A3V3: C21.2 C22.2 C30.2 C31.2 C32.2 R5.2 U1.24(AVDD33) U1.30(AVDD33) U1.47(AVDD33) U6.2
D3V3: C13.2 C19.2 C20.2 C23.2 C24.2 C25.2 L3.2 R14.2 U1.16(DVDD33) U1.23(DVDD33) U1.44(DVDD33) U6.1
GND: C1.1 C2.1 C3.2 C4.1 C5.2 C6.2 C7.2 C8.1 C9.2 C10.1 C11.1 C12.1 C14.1 C15.1 C16.1 C17.1 C18.1 C19.1 C20.1 C21.1 C22.1 C23.1 C24.1 C25.1 C26.1 C28.1 C29.1 C30.1 C31.1 C32.1 C33.2 C34.2 C35.2 C36.2 C37.2 D1.3(GND) D1.8(GND) D2.3(GND) D2.8(GND) H1.6 HDMI1.2(D2_SHIELD) HDMI1.5(D1_SHIELD) HDMI1.8(D0_SHIELD) HDMI1.11(CK_SHIELD) HDMI1.17(GND) HDMI1.20(SHD) HDMI1.21(SHD) HDMI1.22(SHD) HDMI1.23(SHD) LED2.2(GND) Q1.2(S) R1.2 R9.1 R10.1 R11.1 R12.1 R15.1 R17.1 SW1.1 SW2.1 U1.15(VSS) U1.20(VSS) U1.36(VSS) U1.40(GPIO1) U1.42(VSS) U1.43(VSS) U1.46(VSS) U1.48(VSS) U1.49(EP) U2.1(A0) U2.2(A1) U2.3(A2) U2.4(GND) U3.8(VSS) U4.29(EP) U5.2(GND) U7.2(GND) U10.1(GND) U11.8(VSS) U12.5(GND) USBC1.0(SH) USBC1.1(SH) USBC1.2(SH) USBC1.3(SH) USBC1.A1(GND) USBC1.A12(GND) USBC1.B1(GND) USBC1.B12(GND) USBC2.0(SH) USBC2.1(SH) USBC2.2(SH) USBC2.3(SH) USBC2.A1(GND) USBC2.A12(GND) USBC2.B1(GND) USBC2.B12(GND) X1.2(GND) X1.4(GND) X2.2(GND) X2.4(GND) X3.2(GND) X3.4(GND) X5.2(GND) X5.4(GND)
V33USB_2: U1.7(V33USB) U8.2
VBUS: D8.2(A) USBC2.A4(VBUS) USBC2.A9(VBUS) USBC2.B4(VBUS) USBC2.B9(VBUS)
VBUS1: D7.2(A) H1.5 USBC1.A4(VBUS) USBC1.A9(VBUS) USBC1.B4(VBUS) USBC1.B9(VBUS)
VDD18: C5.1 U3.10(VDD18)
VDD33: C6.1 U3.9(VDD33)
ANT: L1.1 U4.21(ANT)
BOOT: SW1.2 U4.17(PB22/TMR3/RXD2)
CC1: R12.2 USBC2.A5(CC1)
CC1_B: R11.2 USBC1.A5(CC1)
CC2: R10.2 USBC2.B5(CC2)
CC2_B: R9.2 USBC1.B5(CC2)
DM4: U1.5(USBDM) U3.13(DM4)
DP4: U1.4(USBDP) U3.14(DP4)
EN#: U4.28(PA12/SCS/PWM4/AIN2) U12.9(EN#)
HDMI_0N: D2.2(IN2) D2.9(NC) HDMI1.9(D0-) U1.28(HDMIRX0N)
HDMI_0P: D2.1(IN1) D2.10(NC) HDMI1.7(D0+) U1.29(HDMIRX0P)
HDMI_1N: D1.5(IN4) D1.6(NC) HDMI1.6(D1-) U1.31(HDMIRX1N)
HDMI_1P: D1.4(IN3) D1.7(NC) HDMI1.4(D1+) U1.32(HDMIRX1P)
HDMI_2N: D1.2(IN2) D1.9(NC) HDMI1.3(D2-) U1.34(HDMIRX2N)
HDMI_2P: D1.1(IN1) D1.10(NC) HDMI1.1(D2+) U1.35(HDMIRX2P)
HDMI_CN: D2.5(IN4) D2.6(NC) HDMI1.12(CK-) U1.25(HDMIRXCN)
HDMI_CP: D2.4(IN3) D2.7(NC) HDMI1.10(CK+) U1.26(HDMIRXCP)
HDMIDET: R2.1 U1.18(HDMIRXDET)
HDMIHPD: HDMI1.19(HOT_PLUG_DET) U1.17(HDMIRXHPD)
HDMISCL: HDMI1.15(I2C-CLK) R3.2 U1.22(RXDDCSCL)
HDMISDA: HDMI1.16(I2C_DATA) R4.2 U1.21(RXDDCSDA)
HXIN: C2.2 U1.1(XTIN) X1.3(OSC2)
HXOUT: C4.2 U1.2(XTOUT) X1.1(OSC1)
IN: U4.14(PB7/TXD0/PWM9) U12.1(IN)
PWM5: LED2.3(DI) U4.27(PA13/SCK0/PWM5/AIN3)
PWM7: Q1.1(G) R18.1 U4.15(PB4/RXD0/PWM7)
RST: SW2.2 U4.16(PB23/RST/TMR0_/TXD2_/PWM11)
RXD1: H1.1 U4.6(PA8/RXD1/AIN12)
SCL: R7.1 U1.13(GPIO2(SCL)) U2.6(SCL)
SDA: R8.1 U1.14(GPIO3(SDA)) U2.5(SDA)
STATUS: LED1.1(C) U1.39(GPIO0)
SWCLK: H1.2 U4.8(PB15/TCK/MISO_/DTR_)
SWDIO: H1.4 U4.9(PB14/TIO/DSR_/MOSI_/PWM10)
TXD1: H1.3 U4.7(PA9/TMR0/TXD1/AIN13)
USB0_N: U3.15(DM3) U4.13(PB10/UD-/TMR1_)
USB0_P: U3.16(DP3) U4.12(PB11/UD+/TMR2_)
USB0B_N: U3.1(DM2) U12.8(S1C)
USB0B_P: U3.2(DP2) U12.2(S1B)
USB1_N: U11.5(UDM) USBC1.A7(DN1) USBC1.B7(DN2)
USB1_P: U11.6(UDP) USBC1.A6(DP1) USBC1.B6(DP2)
USB1A_N: U4.11(PB12/U2D-/SCS_/SDA/RXD1_) U11.3(DM1)
USB1A_P: U4.10(PB13/U2D+/SCK0_/SCL/TXD1_) U11.4(DP1)
USB1B_N: U11.15(DM3) U12.7(S2C)
USB1B_P: U11.16(DP3) U12.3(S2B)
USB_N: U3.5(UDM) USBC2.A7(DN1) USBC2.B7(DN2)
USB_P: U3.6(UDP) USBC2.A6(DP1) USBC2.B6(DP2)
USBA_N: U12.6(DC) USB2.2(D-)
USBA_P: U12.4(DB) USB2.3(D+)
VDCIA: C9.1 C11.2 C12.2 L2.2 U4.3(VDCID) U4.22(VDCIA)
VSW: L2.1 U4.4(VSW)
WP: R6.1 U1.37(GPIO5) U2.7(WP)
X32KI: U4.2(PA10/X32KI/TMR1) X4.2
X32KO: U4.1(PA11/X32KO/TMR2) X4.1
X32MI: U4.19(X32MI) X3.1(OSC1)
X32MO: U4.18(X32MO) X3.3(OSC2)
XIN: U3.12(XIN) X2.1(OSC1)
XIN_2: U11.12(XIN) X5.1(OSC1)
XOUT: U3.11(XOUT) X2.3(OSC2)
XOUT_2: U11.11(XOUT) X5.3(OSC2)
$1N21165: C1.2 HDMI1.18(+5V) R2.2 R3.1 R4.1
$1N21216: C3.1 D6.1(C) R6.2 R7.2 R8.2 U2.8(VCC)
$1N21222: R1.1 U1.3(REXT)
$2N50514: C35.1 U11.9(VDD33)
$2N50518: C36.1 U11.10(VDD18)
$2N52477: Q1.3(D) USB2.4(GND) USB2.SH1 USB2.SH2
$3N20985: C10.2 U4.20(VINTA)
$4N9330: C27.1 R16.1 R17.2 U7.5(FB)
$4N9333: C13.1 R14.1 R15.2 U5.5(FB)
$4N12688: L4.1 U7.3(SW)
$4N12690: L3.1 U5.3(SW)
Net-(LED1-2): LED1.2(A) R5.1

Not connected (* = marked no-connect by the designer): HDMI1 13(CEC)* 14(HEC)*; L1 2*; LED2 1(DO)*; U1 9(I2SIN_SCLK)* 10(I2SIN_WS)* 11(I2SIN_SD0)* 12(I2S_MCLKOUT)* 38(SPDIFOUT)* 45(MCU_SEL)*; U3 3(DM1)* 4(DP1)*; U4 23(PA4/RXD3/AIN0)* 24(PA5/TXD3/AIN1)* 25(PA15/MISO/RXD0_/AIN5)* 26(PA14/MOSI/TXD0_/AIN4)*; U11 1(DM2)* 2(DP2)* 13(DM4)* 14(DP4)*; USBC1 A8(SBU1)* B8(SBU2)*; USBC2 A8(SBU1)* B8(SBU2)*

## Notes on the sheets
sheet 2
- Type-C UP
- SL2.1A UP
- CH442E
- ch442
- ch582
- ms2109
- Type-C DN
- SL2.1A DN
- ch442
- ch582
sheet 3
- Optional
- Bluetooth
  Optional
- Bluetooth
  Optional
- Optional
